# Altium schematic sheet Slave.SchDoc: Slave
size A3; Author: Arjan Blankestijn; Revision: V1; SheetNumber: 2; SheetTotal: 3; Author2: Bram Bremer; Team: 2024; ProjectPrettyName: BMS; Subsystem: Module Board
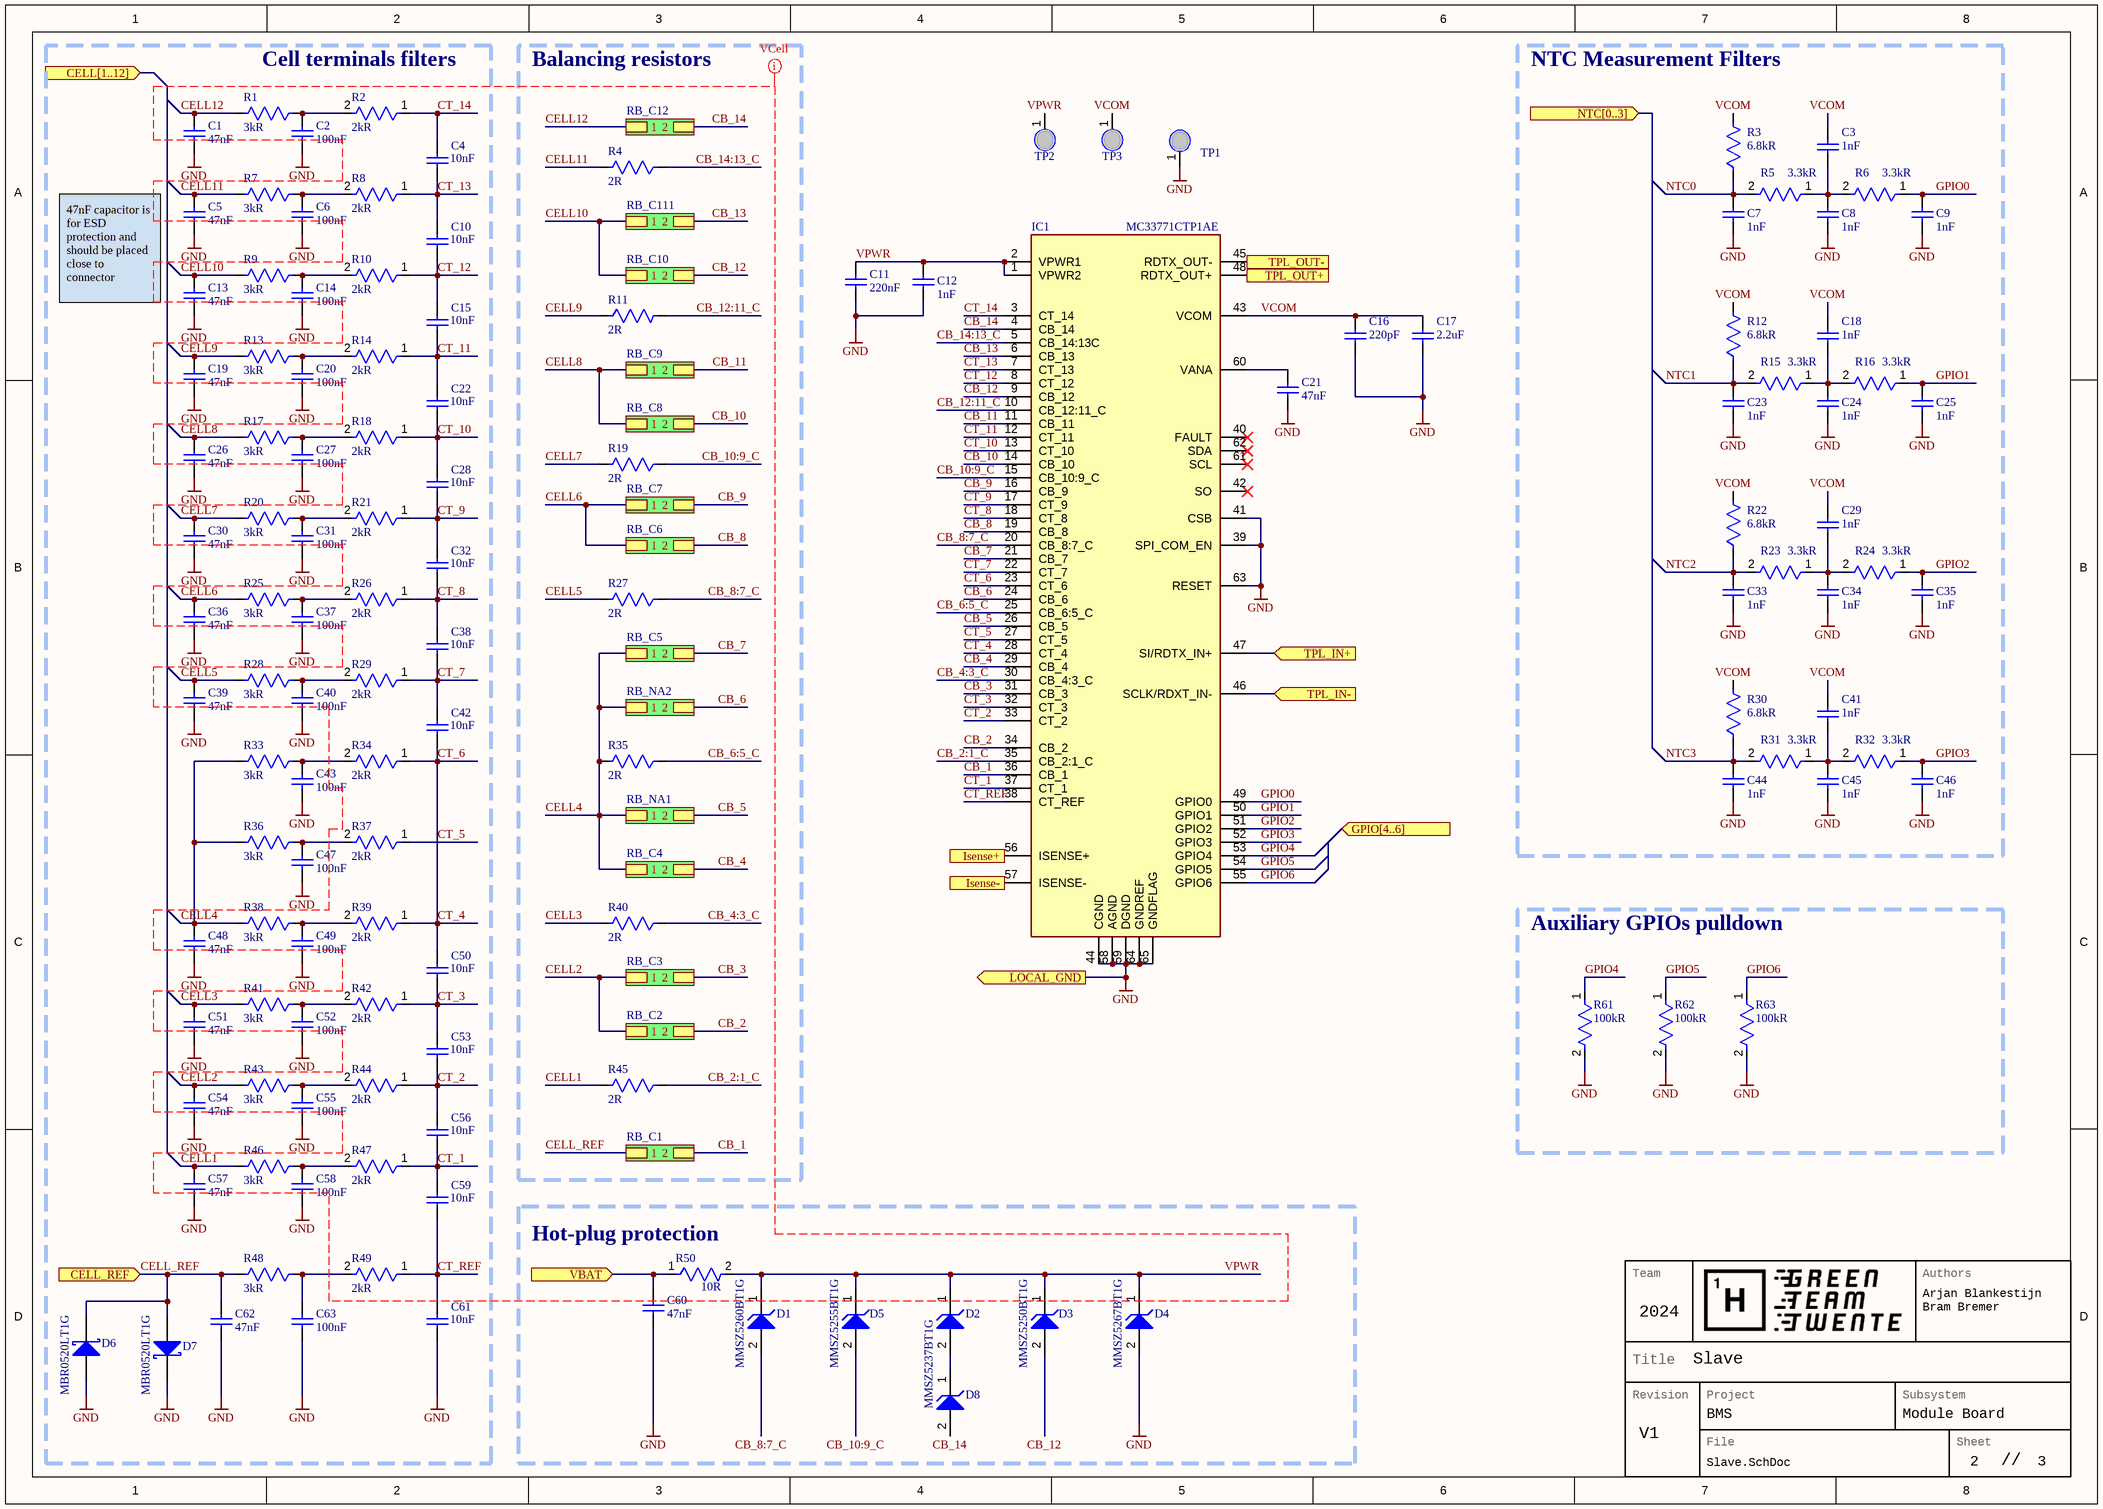
[diagram p0: Slave.SchDoc]

## Parts
C1  value 47nF  [WCAP-CSGP_0603_L1.6W0.8H0.8_Reflow]  (hidden comment: CAP 0603 47nF X7R)
C2  value 100nF  [WCAP-CSGP_0603_L1.6W0.8H0.8_Reflow]  (hidden comment: CAP 0603 100nF X7R)
C3  value 1nF  [WCAP-CSGP_0402_L1W0.5H0.5]  (hidden comment: CAP 0402 1nF X7R)
C4  value 10nF  [WCAP-CSGP_0402_L1W0.5H0.5]  (hidden comment: CAP 0402 10nF X7R)
C5  value 47nF  [WCAP-CSGP_0603_L1.6W0.8H0.8_Reflow]  (hidden comment: CAP 0603 47nF X7R)
C6  value 100nF  [WCAP-CSGP_0603_L1.6W0.8H0.8_Reflow]  (hidden comment: CAP 0603 100nF X7R)
C7  value 1nF  [WCAP-CSGP_0402_L1W0.5H0.5]  (hidden comment: CAP 0402 1nF X7R)
C8  value 1nF  [WCAP-CSGP_0402_L1W0.5H0.5]  (hidden comment: CAP 0402 1nF X7R)
C9  value 1nF  [WCAP-CSGP_0402_L1W0.5H0.5]  (hidden comment: CAP 0402 1nF X7R)
C10  value 10nF  [WCAP-CSGP_0402_L1W0.5H0.5]  (hidden comment: CAP 0402 10nF X7R)
C11  value 220nF  [WCAP-CSGP_0603_L1.6W0.8H0.8_Reflow]  (hidden comment: CAP 0603 220nF X7R)
C12  value 1nF  [WCAP-CSGP_0402_L1W0.5H0.5]  (hidden comment: CAP 0402 1nF X7R)
C13  value 47nF  [WCAP-CSGP_0603_L1.6W0.8H0.8_Reflow]  (hidden comment: CAP 0603 47nF X7R)
C14  value 100nF  [WCAP-CSGP_0603_L1.6W0.8H0.8_Reflow]  (hidden comment: CAP 0603 100nF X7R)
C15  value 10nF  [WCAP-CSGP_0402_L1W0.5H0.5]  (hidden comment: CAP 0402 10nF X7R)
C16  value 220pF  [WCAP-CSGP_0402_L1W0.5H0.5]  (hidden comment: CAP 0402 220pF X7R)
C17  value 2.2uF  [WCAP-CSGP_0603_L1.6W0.8H0.8_Reflow]  (hidden comment: CAP 0603 2.2uF X7R)
C18  value 1nF  [WCAP-CSGP_0402_L1W0.5H0.5]  (hidden comment: CAP 0402 1nF X7R)
C19  value 47nF  [WCAP-CSGP_0603_L1.6W0.8H0.8_Reflow]  (hidden comment: CAP 0603 47nF X7R)
C20  value 100nF  [WCAP-CSGP_0603_L1.6W0.8H0.8_Reflow]  (hidden comment: CAP 0603 100nF X7R)
C21  value 47nF  [WCAP-CSGP_0603_L1.6W0.8H0.8_Reflow]  (hidden comment: CAP 0603 47nF X7R)
C22  value 10nF  [WCAP-CSGP_0402_L1W0.5H0.5]  (hidden comment: CAP 0402 10nF X7R)
C23  value 1nF  [WCAP-CSGP_0402_L1W0.5H0.5]  (hidden comment: CAP 0402 1nF X7R)
C24  value 1nF  [WCAP-CSGP_0402_L1W0.5H0.5]  (hidden comment: CAP 0402 1nF X7R)
C25  value 1nF  [WCAP-CSGP_0402_L1W0.5H0.5]  (hidden comment: CAP 0402 1nF X7R)
C26  value 47nF  [WCAP-CSGP_0603_L1.6W0.8H0.8_Reflow]  (hidden comment: CAP 0603 47nF X7R)
C27  value 100nF  [WCAP-CSGP_0603_L1.6W0.8H0.8_Reflow]  (hidden comment: CAP 0603 100nF X7R)
C28  value 10nF  [WCAP-CSGP_0402_L1W0.5H0.5]  (hidden comment: CAP 0402 10nF X7R)
C29  value 1nF  [WCAP-CSGP_0402_L1W0.5H0.5]  (hidden comment: CAP 0402 1nF X7R)
C30  value 47nF  [WCAP-CSGP_0603_L1.6W0.8H0.8_Reflow]  (hidden comment: CAP 0603 47nF X7R)
C31  value 100nF  [WCAP-CSGP_0603_L1.6W0.8H0.8_Reflow]  (hidden comment: CAP 0603 100nF X7R)
C32  value 10nF  [WCAP-CSGP_0402_L1W0.5H0.5]  (hidden comment: CAP 0402 10nF X7R)
C33  value 1nF  [WCAP-CSGP_0402_L1W0.5H0.5]  (hidden comment: CAP 0402 1nF X7R)
C34  value 1nF  [WCAP-CSGP_0402_L1W0.5H0.5]  (hidden comment: CAP 0402 1nF X7R)
C35  value 1nF  [WCAP-CSGP_0402_L1W0.5H0.5]  (hidden comment: CAP 0402 1nF X7R)
C36  value 47nF  [WCAP-CSGP_0603_L1.6W0.8H0.8_Reflow]  (hidden comment: CAP 0603 47nF X7R)
C37  value 100nF  [WCAP-CSGP_0603_L1.6W0.8H0.8_Reflow]  (hidden comment: CAP 0603 100nF X7R)
C38  value 10nF  [WCAP-CSGP_0402_L1W0.5H0.5]  (hidden comment: CAP 0402 10nF X7R)
C39  value 47nF  [WCAP-CSGP_0603_L1.6W0.8H0.8_Reflow]  (hidden comment: CAP 0603 47nF X7R)
C40  value 100nF  [WCAP-CSGP_0603_L1.6W0.8H0.8_Reflow]  (hidden comment: CAP 0603 100nF X7R)
C41  value 1nF  [WCAP-CSGP_0402_L1W0.5H0.5]  (hidden comment: CAP 0402 1nF X7R)
C42  value 10nF  [WCAP-CSGP_0402_L1W0.5H0.5]  (hidden comment: CAP 0402 10nF X7R)
C43  value 100nF  [WCAP-CSGP_0603_L1.6W0.8H0.8_Reflow]  (hidden comment: CAP 0603 100nF X7R)
C44  value 1nF  [WCAP-CSGP_0402_L1W0.5H0.5]  (hidden comment: CAP 0402 1nF X7R)
C45  value 1nF  [WCAP-CSGP_0402_L1W0.5H0.5]  (hidden comment: CAP 0402 1nF X7R)
C46  value 1nF  [WCAP-CSGP_0402_L1W0.5H0.5]  (hidden comment: CAP 0402 1nF X7R)
C47  value 100nF  [WCAP-CSGP_0603_L1.6W0.8H0.8_Reflow]  (hidden comment: CAP 0603 100nF X7R)
C48  value 47nF  [WCAP-CSGP_0603_L1.6W0.8H0.8_Reflow]  (hidden comment: CAP 0603 47nF X7R)
C49  value 100nF  [WCAP-CSGP_0603_L1.6W0.8H0.8_Reflow]  (hidden comment: CAP 0603 100nF X7R)
C50  value 10nF  [WCAP-CSGP_0402_L1W0.5H0.5]  (hidden comment: CAP 0402 10nF X7R)
C51  value 47nF  [WCAP-CSGP_0603_L1.6W0.8H0.8_Reflow]  (hidden comment: CAP 0603 47nF X7R)
C52  value 100nF  [WCAP-CSGP_0603_L1.6W0.8H0.8_Reflow]  (hidden comment: CAP 0603 100nF X7R)
C53  value 10nF  [WCAP-CSGP_0402_L1W0.5H0.5]  (hidden comment: CAP 0402 10nF X7R)
C54  value 47nF  [WCAP-CSGP_0603_L1.6W0.8H0.8_Reflow]  (hidden comment: CAP 0603 47nF X7R)
C55  value 100nF  [WCAP-CSGP_0603_L1.6W0.8H0.8_Reflow]  (hidden comment: CAP 0603 100nF X7R)
C56  value 10nF  [WCAP-CSGP_0402_L1W0.5H0.5]  (hidden comment: CAP 0402 10nF X7R)
C57  value 47nF  [WCAP-CSGP_0603_L1.6W0.8H0.8_Reflow]  (hidden comment: CAP 0603 47nF X7R)
C58  value 100nF  [WCAP-CSGP_0603_L1.6W0.8H0.8_Reflow]  (hidden comment: CAP 0603 100nF X7R)
C59  value 10nF  [WCAP-CSGP_0402_L1W0.5H0.5]  (hidden comment: CAP 0402 10nF X7R)
C60  value 47nF  [WCAP-CSGP_0603_L1.6W0.8H0.8_Reflow]  (hidden comment: CAP 0603 47nF X7R)
C61  value 10nF  [WCAP-CSGP_0402_L1W0.5H0.5]  (hidden comment: CAP 0402 10nF X7R)
C62  value 47nF  [WCAP-CSGP_0603_L1.6W0.8H0.8_Reflow]  (hidden comment: CAP 0603 47nF X7R)
C63  value 100nF  [WCAP-CSGP_0603_L1.6W0.8H0.8_Reflow]  (hidden comment: CAP 0603 100nF X7R)
D1  MMSZ5260BT1G  [ONSC-SOD-123-2-425-04_V]
D2  MMSZ5237BT1G  [ONSC-SOD-123-2-425-04_V]
D3  MMSZ5250BT1G  [ONSC-SOD-123-2-425-04_V]
D4  MMSZ5267BT1G  [ONSC-SOD-123-2-425-04_V]
D5  MMSZ5255BT1G  [ONSC-SOD-123-2-425-04_V]
D6  MBR0520LT1G  [ONSC-SOD-123-2-425-04_V]
D7  MBR0520LT1G  [ONSC-SOD-123-2-425-04_V]
D8  MMSZ5237BT1G  [ONSC-SOD-123-2-425-04_V]  (value not drawn)
IC1  MC33771CTP1AE  [QFP50P1200X1200X160-65N]
R1  value 3kR  [RES_SM0603_YAGEORC_N]  (hidden comment: RES 0603 3kR 1%)
R2  value 2kR  [FP0402]  (hidden comment: RES 0402 2kR 1%)
R3  value 6.8kR  [RES_SM0603_YAGEORC_N]  (hidden comment: RES 0603 6.8kR 1%)
R4  value 2R  [RES_SM0603_YAGEORC_N]  (hidden comment: RES 0603 2R 1%)
R5  value 3.3kR  [FP0402]  (hidden comment: RES 0402 3.3kR 1%)
R6  value 3.3kR  [FP0402]  (hidden comment: RES 0402 3.3kR 1%)
R7  value 3kR  [RES_SM0603_YAGEORC_N]  (hidden comment: RES 0603 3kR 1%)
R8  value 2kR  [FP0402]  (hidden comment: RES 0402 2kR 1%)
R9  value 3kR  [RES_SM0603_YAGEORC_N]  (hidden comment: RES 0603 3kR 1%)
R10  value 2kR  [FP0402]  (hidden comment: RES 0402 2kR 1%)
R11  value 2R  [RES_SM0603_YAGEORC_N]  (hidden comment: RES 0603 2R 1%)
R12  value 6.8kR  [RES_SM0603_YAGEORC_N]  (hidden comment: RES 0603 6.8kR 1%)
R13  value 3kR  [RES_SM0603_YAGEORC_N]  (hidden comment: RES 0603 3kR 1%)
R14  value 2kR  [FP0402]  (hidden comment: RES 0402 2kR 1%)
R15  value 3.3kR  [FP0402]  (hidden comment: RES 0402 3.3kR 1%)
R16  value 3.3kR  [FP0402]  (hidden comment: RES 0402 3.3kR 1%)
R17  value 3kR  [RES_SM0603_YAGEORC_N]  (hidden comment: RES 0603 3kR 1%)
R18  value 2kR  [FP0402]  (hidden comment: RES 0402 2kR 1%)
R19  value 2R  [RES_SM0603_YAGEORC_N]  (hidden comment: RES 0603 2R 1%)
R20  value 3kR  [RES_SM0603_YAGEORC_N]  (hidden comment: RES 0603 3kR 1%)
R21  value 2kR  [FP0402]  (hidden comment: RES 0402 2kR 1%)
R22  value 6.8kR  [RES_SM0603_YAGEORC_N]  (hidden comment: RES 0603 6.8kR 1%)
R23  value 3.3kR  [FP0402]  (hidden comment: RES 0402 3.3kR 1%)
R24  value 3.3kR  [FP0402]  (hidden comment: RES 0402 3.3kR 1%)
R25  value 3kR  [RES_SM0603_YAGEORC_N]  (hidden comment: RES 0603 3kR 1%)
R26  value 2kR  [FP0402]  (hidden comment: RES 0402 2kR 1%)
R27  value 2R  [RES_SM0603_YAGEORC_N]  (hidden comment: RES 0603 2R 1%)
R28  value 3kR  [RES_SM0603_YAGEORC_N]  (hidden comment: RES 0603 3kR 1%)
R29  value 2kR  [FP0402]  (hidden comment: RES 0402 2kR 1%)
R30  value 6.8kR  [RES_SM0603_YAGEORC_N]  (hidden comment: RES 0603 6.8kR 1%)
R31  value 3.3kR  [FP0402]  (hidden comment: RES 0402 3.3kR 1%)
R32  value 3.3kR  [FP0402]  (hidden comment: RES 0402 3.3kR 1%)
R33  value 3kR  [RES_SM0603_YAGEORC_N]  (hidden comment: RES 0603 3kR 1%)
R34  value 2kR  [FP0402]  (hidden comment: RES 0402 2kR 1%)
R35  value 2R  [RES_SM0603_YAGEORC_N]  (hidden comment: RES 0603 2R 1%)
R36  value 3kR  [RES_SM0603_YAGEORC_N]  (hidden comment: RES 0603 3kR 1%)
R37  value 2kR  [FP0402]  (hidden comment: RES 0402 2kR 1%)
R38  value 3kR  [RES_SM0603_YAGEORC_N]  (hidden comment: RES 0603 3kR 1%)
R39  value 2kR  [FP0402]  (hidden comment: RES 0402 2kR 1%)
R40  value 2R  [RES_SM0603_YAGEORC_N]  (hidden comment: RES 0603 2R 1%)
R41  value 3kR  [RES_SM0603_YAGEORC_N]  (hidden comment: RES 0603 3kR 1%)
R42  value 2kR  [FP0402]  (hidden comment: RES 0402 2kR 1%)
R43  value 3kR  [RES_SM0603_YAGEORC_N]  (hidden comment: RES 0603 3kR 1%)
R44  value 2kR  [FP0402]  (hidden comment: RES 0402 2kR 1%)
R45  value 2R  [RES_SM0603_YAGEORC_N]  (hidden comment: RES 0603 2R 1%)
R46  value 3kR  [RES_SM0603_YAGEORC_N]  (hidden comment: RES 0603 3kR 1%)
R47  value 2kR  [FP0402]  (hidden comment: RES 0402 2kR 1%)
R48  value 3kR  [RES_SM0603_YAGEORC_N]  (hidden comment: RES 0603 3kR 1%)
R49  value 2kR  [FP0402]  (hidden comment: RES 0402 2kR 1%)
R50  value 10R  [RES_SM1206_YAGEORC_N]  (hidden comment: RES 1206 10R 1%)
R61  value 100kR  [FP0402]  (hidden comment: RES 0402 100kR 1%)
R62  value 100kR  [FP0402]  (hidden comment: RES 0402 100kR 1%)
R63  value 100kR  [FP0402]  (hidden comment: RES 0402 100kR 1%)
TP1  GTT_ProbeerPunt  [GTT_ProbeerPuntFP]  (value not drawn)  (no BOM)
TP2  GTT_ProbeerPunt  [GTT_ProbeerPuntFP]  (value not drawn)  (no BOM)
TP3  GTT_ProbeerPunt  [GTT_ProbeerPuntFP]  (value not drawn)  (no BOM)

## Blocks framed on the sheet
Cell terminals filters: C1 C2 C4-C6 C10 C13-C15 C19 C20 C22 C26-C28 C30-C32 C36-C40 C42 C43 C47-C59 C61-C63 D6 D7 R1 R2 R7-R10 R13 R14 R17 R18 R20 R21 R25 R26 R28 R29 R33 R34 R36-R39 R41-R44 R46-R49
Balancing resistors: R4 R11 R19 R27 R35 R40 R45
NTC Measurement Filters: C3 C7-C9 C18 C23-C25 C29 C33-C35 C41 C44-C46 R3 R5 R6 R12 R15 R16 R22-R24 R30-R32
Auxiliary GPIOs pulldown: R61-R63
Hot-plug protection: C60 D1-D5 D8 R50

## Sub-sheets
RB_C1 = BalancingNetwork.SchDoc: 1, 2
RB_C2 = BalancingNetwork.SchDoc: 1, 2
RB_C3 = BalancingNetwork.SchDoc: 1, 2
RB_C4 = BalancingNetwork.SchDoc: 1, 2
RB_C5 = BalancingNetwork.SchDoc: 1, 2
RB_C6 = BalancingNetwork.SchDoc: 1, 2
RB_C7 = BalancingNetwork.SchDoc: 1, 2
RB_C8 = BalancingNetwork.SchDoc: 1, 2
RB_C9 = BalancingNetwork.SchDoc: 1, 2
RB_C10 = BalancingNetwork.SchDoc: 1, 2
RB_C12 = BalancingNetwork.SchDoc: 1, 2
RB_C111 = BalancingNetwork.SchDoc: 1, 2
RB_NA1 = BalancingNetwork.SchDoc: 1, 2
RB_NA2 = BalancingNetwork.SchDoc: 1, 2

## Ports
CELL[1..12] (in), CELL_REF (in), GPIO[4..6] (in), Isense+ (in), Isense- (in), LOCAL_GND (out), NTC[0..3] (in), TPL_IN+ (in), TPL_IN- (in), TPL_OUT+ (out), TPL_OUT- (out), VBAT (in)

## Nets
GND: C1.1 C2.1 C5.1 C6.1 C7.1 C8.1 C9.1 C11.1 C12.1 C13.1 C14.1 C16.1 C17.1 C19.1 C20.1 C21.1 C23.1 C24.1 C25.1 C26.1 C27.1 C30.1 C31.1 C33.1 C34.1 C35.1 C36.1 C37.1 C39.1 C40.1 C43.1 C44.1 C45.1 C46.1 C47.1 C48.1 C49.1 C51.1 C52.1 C54.1 C55.1 C57.1 C58.1 C60.1 C61.1 C62.1 C63.1 D4.2(A) D6.1(A) D7.2(K) IC1.39(SPI_COM_EN) IC1.41(CSB) IC1.44(CGND) IC1.58(AGND) IC1.59(DGND) IC1.63(RESET) IC1.64(GNDREF) IC1.65(GNDFLAG) R61.2 R62.2 R63.2 TP1.1 ; port LOCAL_GND
CB_1: IC1.36(CB_1) ; sheet RB_C1/2
CB_2: IC1.34(CB_2) ; sheet RB_C2/2
CB_2:1_C: IC1.35(CB_2:1_C) R45.1
CB_3: IC1.31(CB_3) ; sheet RB_C3/2
CB_4: IC1.29(CB_4) ; sheet RB_C4/2
CB_4:3_C: IC1.30(CB_4:3_C) R40.1
CB_5: IC1.26(CB_5) ; sheet RB_NA1/2
CB_6: IC1.24(CB_6) ; sheet RB_NA2/2
CB_6:5_C: IC1.25(CB_6:5_C) R35.1
CB_7: IC1.21(CB_7) ; sheet RB_C5/2
CB_8: IC1.19(CB_8) ; sheet RB_C6/2
CB_8:7_C: D1.2(A) IC1.20(CB_8:7_C) R27.1
CB_9: IC1.16(CB_9) ; sheet RB_C7/2
CB_10: IC1.14(CB_10) ; sheet RB_C8/2
CB_10:9_C: D5.2(A) IC1.15(CB_10:9_C) R19.1
CB_11: IC1.11(CB_11) ; sheet RB_C9/2
CB_12: D3.2(A) IC1.9(CB_12) ; sheet RB_C10/2
CB_12:11_C: IC1.10(CB_12:11_C) R11.2
CB_13: IC1.6(CB_13) ; sheet RB_C111/2
CB_14: D8.2(A) IC1.4(CB_14) ; sheet RB_C12/2
CB_14:13_C: IC1.5(CB_14:13C) R4.1
CELL1: C57.2 R45.2 R46.2
CELL2: C54.2 R43.2 ; sheet RB_C3/1, sheet RB_C2/1
CELL3: C51.2 R40.2 R41.2
CELL4: C48.2 R33.2 R35.2 R36.2 R38.2 ; sheet RB_NA1/1, sheet RB_C4/1, sheet RB_C5/1, sheet RB_NA2/1
CELL5: C39.2 R27.2 R28.2
CELL6: C36.2 R25.2 ; sheet RB_C7/1, sheet RB_C6/1
CELL7: C30.2 R19.2 R20.2
CELL8: C26.2 R17.2 ; sheet RB_C9/1, sheet RB_C8/1
CELL9: C19.2 R11.1 R13.2
CELL10: C13.2 R9.2 ; sheet RB_C10/1, sheet RB_C111/1
CELL11: C5.2 R4.2 R7.2
CELL12: C1.2 R1.2 ; sheet RB_C12/1
CELL_REF: C62.2 D6.2(K) D7.1(A) R48.2 ; port CELL_REF, sheet RB_C1/1
CT_1: C56.1 C59.2 IC1.37(CT_1) R47.1
CT_2: C53.1 C56.2 IC1.33(CT_2) R44.1
CT_3: C50.1 C53.2 IC1.32(CT_3) R42.1
CT_4: C42.1 C50.2 IC1.23(CT_6) IC1.27(CT_5) IC1.28(CT_4) R34.1 R37.1 R39.1  [also labelled CT_5, CT_6]
CT_7: C38.1 C42.2 IC1.22(CT_7) R29.1
CT_8: C32.1 C38.2 IC1.18(CT_8) R26.1
CT_9: C28.1 C32.2 IC1.17(CT_9) R21.1
CT_10: C22.1 C28.2 IC1.13(CT_10) R18.1
CT_11: C15.1 C22.2 IC1.12(CT_11) R14.1
CT_12: C10.1 C15.2 IC1.8(CT_12) R10.1
CT_13: C4.1 C10.2 IC1.7(CT_13) R8.1
CT_14: C4.2 IC1.3(CT_14) R2.1
CT_REF: C59.1 C61.2 IC1.38(CT_REF) R49.1
GPIO0: C9.2 IC1.49(GPIO0) R6.1
GPIO1: C25.2 IC1.50(GPIO1) R16.1
GPIO2: C35.2 IC1.51(GPIO2) R24.1
GPIO3: C46.2 IC1.52(GPIO3) R32.1
GPIO4: IC1.53(GPIO4) R61.1
GPIO5: IC1.54(GPIO5) R62.1
GPIO6: IC1.55(GPIO6) R63.1
Isense+: IC1.56(ISENSE+) ; port Isense+
Isense-: IC1.57(ISENSE-) ; port Isense-
NTC0: C7.2 R3.1 R5.2
NTC1: C23.2 R12.1 R15.2
NTC2: C33.2 R22.1 R23.2
NTC3: C44.2 R30.1 R31.2
TPL_IN+: IC1.47(SI/RDTX_IN+) ; port TPL_IN+
TPL_IN-: IC1.46(SCLK/RDXT_IN-) ; port TPL_IN-
TPL_OUT+: IC1.48(RDTX_OUT+) ; port TPL_OUT+
TPL_OUT-: IC1.45(RDTX_OUT-) ; port TPL_OUT-
VBAT: C60.2 R50.1 ; port VBAT
VCOM: C3.2 C16.2 C17.2 C18.2 C29.2 C41.2 IC1.43(VCOM) R3.2 R12.2 R22.2 R30.2 TP3.1
VPWR: C11.2 C12.2 D1.1(K) D2.1(K) D3.1(K) D4.1(K) D5.1(K) IC1.1(VPWR2) IC1.2(VPWR1) R50.2 TP2.1
NetC2_2: C2.2 R1.1 R2.2
NetC3_1: C3.1 C8.2 R5.1 R6.2
NetC6_2: C6.2 R7.1 R8.2
NetC14_2: C14.2 R9.1 R10.2
NetC18_1: C18.1 C24.2 R15.1 R16.2
NetC20_2: C20.2 R13.1 R14.2
NetC21_2: C21.2 IC1.60(VANA)
NetC27_2: C27.2 R17.1 R18.2
NetC29_1: C29.1 C34.2 R23.1 R24.2
NetC31_2: C31.2 R20.1 R21.2
NetC37_2: C37.2 R25.1 R26.2
NetC40_2: C40.2 R28.1 R29.2
NetC41_1: C41.1 C45.2 R31.1 R32.2
NetC43_2: C43.2 R33.1 R34.2
NetC47_2: C47.2 R36.1 R37.2
NetC49_2: C49.2 R38.1 R39.2
NetC52_2: C52.2 R41.1 R42.2
NetC55_2: C55.2 R43.1 R44.2
NetC58_2: C58.2 R46.1 R47.2
NetC63_2: C63.2 R48.1 R49.2
NetD2_2: D2.2(A) D8.1(K)

Not connected (* = marked no-connect by the designer): IC1 40(FAULT)* 42(SO)* 61(SCL)* 62(SDA)*

## Layout directives
rule Clearance Constraint [Generic clearance = 0.5mm, and 18 value(s) for objects]: CB_1, CB_2, CB_2:1_C, CB_3, CB_4, CB_4:3_C, CB_5, CB_6, CB_6:5_C, CB_7, CB_8, CB_8:7_C, CB_9, CB_10, CB_10:9_C, CB_11, CB_12, CB_12:11_C, CB_13, CB_14, CB_14:13_C, CELL1, CELL2, CELL3, CELL4, CELL5, CELL6, CELL7, CELL8, CELL9, CELL10, CELL11, CELL12, CELL_REF, CT_1, CT_2, CT_3, CT_4, CT_5, CT_6, CT_7, CT_8, CT_9, CT_10, CT_11, CT_12, CT_13, CT_14, CT_REF, VPWR

## Notes on the sheet
- 47nF capacitor is for ESD protection and should be placed close to connector
- Team
- Authors
- Revision
- Title
- Project
- Subsystem
- File
- Sheet
- //

## Library data of the parts
C1 C2 C5 C6 C11 C13 C14 C17 C19-C21 C26 C27 C30 C31 C36 C37 C39 C40 C43 C47-C49 C51 C52 C54 C55 C57 C58 C60 C62 C63 = CMP-001-01309-1: GTT Standard 0603 non-polarized capacitor; Voltage Rating: 100V; Tolerance: 5%; Case/Package: 0603; Category: Multilayer Ceramic Chip Capacitors; Ceramic Type: X7R; Pins: 2
  C1 C5 C13 C19 C21 C26 C30 C36 C39 C48 C51 C54 C57 C60 C62: JLCPCB Part #: C1622
  C2 C6 C14 C20 C27 C31 C37 C40 C43 C47 C49 C52 C55 C58 C63: JLCPCB Part #: C14663
  C11: JLCPCB Part #: C21120
  C17: JLCPCB Part #: C23630
C3 C4 C7-C10 C12 C15 C16 C18 C22-C25 C28 C29 C32-C35 C38 C41 C42 C44-C46 C50 C53 C56 C59 C61 = CMP-001-01308-5: GTT Standard 0402 non-polarized capacitor; Pins: 2; Case/Package: 0402; Category: Multilayer Ceramic Chip Capacitors; Ceramic Type: X7R
  C3 C7-C9 C12 C18 C23-C25 C29 C33-C35 C41 C44-C46: JLCPCB Part #: C1523
  C4 C10 C15 C22 C28 C32 C38 C42 C50 C53 C56 C59 C61: JLCPCB Part #: C15195
  C16: JLCPCB Part #: C1530
D1 = CMP-1060-00447-1: Zener Voltage Regulator, 500 mW, 2-Pin SOD-123, Pb-Free, Tape and Reel; Manufacturer: On Semiconductor; VZ Typ (V): 43; P Max (W): 0.5; Packing: Tape and Reel; ComponentLink3URL: http://www.onsemi.com/pub_link/Collateral/425-04.PDF; DatasheetVersion: Rev. 12; ComponentLink1URL: http://www.onsemi.com/; ComponentLink3Description: Package Specification; PackageVersion: Rev. G, 10/2009; PartNumber: MMSZ5260BT1G; ComponentLink1Description: Manufacturer URL; PackageReference: SOD-123-2-425-04; ComponentLink2URL: http://www.onsemi.com/pub_link/Collateral/MMSZ5221BT1-D.PDF; Mounting Technology: Surface Mount; PackageDescription: 2-Pin SOD, Body 1.6 x 2.69 mm; RoHS: Pb-Free; ComponentLink2Description: Datasheet
D2 D8 = CMP-1060-00553-1: Zener Voltage Regulator, 500 mW, 2-Pin SOD-123, Pb-Free, Tape and Reel; Manufacturer: On Semiconductor; P Max (W): 0.5; VZ Typ (V): 8.2; PartNumber: MMSZ5237BT1G; DatasheetVersion: Rev. 12; ComponentLink1URL: http://www.onsemi.com/; PackageDescription: 2-Pin SOD, Body 1.6 x 2.69 mm; ComponentLink1Description: Manufacturer URL; ComponentLink2URL: http://www.onsemi.com/pub_link/Collateral/MMSZ5221BT1-D.PDF; RoHS: Pb-Free; ComponentLink3URL: http://www.onsemi.com/pub_link/Collateral/425-04.PDF; Mounting Technology: Surface Mount; PackageVersion: Rev. G, 10/2009; ComponentLink2Description: Datasheet; ComponentLink3Description: Package Specification; Packing: Tape and Reel; PackageReference: SOD-123-2-425-04
D3 = CMP-1060-00445-1: Zener Voltage Regulator, 500 mW, 2-Pin SOD-123, Pb-Free, Tape and Reel; Manufacturer: On Semiconductor; VZ Typ (V): 20; P Max (W): 0.5; ComponentLink1URL: http://www.onsemi.com/; ComponentLink2URL: http://www.onsemi.com/pub_link/Collateral/MMSZ5221BT1-D.PDF; Packing: Tape and Reel; ComponentLink3URL: http://www.onsemi.com/pub_link/Collateral/425-04.PDF; ComponentLink3Description: Package Specification; Mounting Technology: Surface Mount; PartNumber: MMSZ5250BT1G; PackageDescription: 2-Pin SOD, Body 1.6 x 2.69 mm; ComponentLink2Description: Datasheet; PackageReference: SOD-123-2-425-04; ComponentLink1Description: Manufacturer URL; PackageVersion: Rev. G, 10/2009; DatasheetVersion: Rev. 12; RoHS: Pb-Free; JLCPCB Part #: C94386
D4 = CMP-1060-00361-1: Zener Voltage Regulator, 500 mW, 2-Pin SOD-123, Pb-Free, Tape and Reel; Manufacturer: On Semiconductor; VZ Typ (V): 75; P Max (W): 0.5; PartNumber: MMSZ5267BT1G; ComponentLink3URL: http://www.onsemi.com/pub_link/Collateral/425-04.PDF; ComponentLink1URL: http://www.onsemi.com/; ComponentLink1Description: Manufacturer URL; ComponentLink2URL: http://www.onsemi.com/pub_link/Collateral/MMSZ5221BT1-D.PDF; Packing: Tape and Reel; Mounting Technology: Surface Mount; DatasheetVersion: Rev. 12; PackageDescription: 2-Pin SOD, Body 1.6 x 2.69 mm; ComponentLink2Description: Datasheet; RoHS: Pb-Free; ComponentLink3Description: Package Specification; PackageVersion: Rev. G, 10/2009; PackageReference: SOD-123-2-425-04; JLCPCB Part #: C80160
D5 = CMP-1060-00445-1: MMSZ5255BT1 Series 500 mW 10 mA 28 V SMT Zener Voltage Regulator - SOD-123; PartNumber: MMSZ5250BT1G; Manufacturer: On Semiconductor; Packing: Tape and Reel; VZ Typ (V): 20; P Max (W): 0.5; ComponentLink1URL: http://www.onsemi.com/; ComponentLink2URL: http://www.onsemi.com/pub_link/Collateral/MMSZ5221BT1-D.PDF; ComponentLink3URL: http://www.onsemi.com/pub_link/Collateral/425-04.PDF; ComponentLink3Description: Package Specification; Mounting Technology: Surface Mount; PackageDescription: 2-Pin SOD, Body 1.6 x 2.69 mm; ComponentLink2Description: Datasheet; PackageReference: SOD-123-2-425-04; ComponentLink1Description: Manufacturer URL; PackageVersion: Rev. G, 10/2009; DatasheetVersion: Rev. 12; RoHS: Pb-Free
D6 D7 = CMP-004-00003-1: Schottky Power Rectifier, 20 V, 5.5 A, -65 to 125 degC, 2-Pin SMD, RoHS, Tape and Reel; Manufacturer: ON Semiconductor; Peak Reverse Current: 250uA; Max Surge Current: 5.5A; Forward Voltage: 3.85dV; Forward Current: 5dA; Elements: 1; Datasheet Version: Rev. 6, 01/2012; Max Operating Temperature: 125°C; RoHS Compliant: True; Manufacturer URL: http://www.onsemi.com/; Packaging: TapeandReel; Datasheet URL: http://www.onsemi.cn/pub_link/Collateral/MBR0520LT1-D.PDF; Package Reference: SOD-123-2-425-04; Package Quantity: 3000; Min Operating Temperature: -65°C; Mounting Technology: SM; Package Description: 2-Pin Surface Mount Device, Body 2.69 x 1.6 mm; Case/Package: SOD; Pins: 2
IC1 = CMP-031-00033-2: Integrated Circuit; Manufacturer_Name: NXP; Design Item ID: MC33771CTP1AE; Arrow Part Number: MC33771CTP1AE; Mouser Price/Stock: https://www.mouser.co.uk/ProductDetail/NXP-Semiconductors/MC33771CTP1AE?qs=wnTfsH77Xs56aES1BMo%252B4w%3D%3D; Arrow Price/Stock: https://www.arrow.com/en/products/mc33771ctp1ae/nxp-semiconductors?region=europe; Height: 1.6mm; Source: TempSchematics.schlib; Datasheet Link: https://eu.mouser.com/datasheet/2/302/PB_MC33771C-1949877.pdf; Manufacturer_Part_Number: MC33771CTP1AE; Mouser Part Number: 771-MC33771CTP1AE
R1 R3 R7 R9 R12 R13 R17 R20 R22 R25 R28 R30 R33 R36 R38 R41 R43 R46 R48 = CMP-009-00206-3: GTT Standard 0603 Resistor; Power: 62.5mW; Voltage Rating: 50V; Tolerance: 1%; Mounting Technology: SMD; Case/Package: 0603
  R1 R7 R9 R13 R17 R20 R25 R28 R33 R36 R38 R41 R43 R46 R48: JLCPCB Part #: C4211
  R3 R12 R22 R30: JLCPCB Part #: C23212
R2 R5 R6 R8 R10 R14-R16 R18 R21 R23 R24 R26 R29 R31 R32 R34 R37 R39 R42 R44 R47 R49 R61-R63 = CMP-009-00204-16: GTT Standard 0402 Resistor; Voltage Rating: 50V; Power: 62.5mW; Case/Package: 0402; Mounting Technology: SMD; Design Item ID: RES 0402; Source: Passives.SchLib; Tolerance: 1%
  R2 R8 R10 R14 R18 R21 R26 R29 R34 R37 R39 R42 R44 R47 R49: JLCPCB Part #: C4109
  R5 R6 R15 R16 R23 R24 R31 R32: JLCPCB Part #: C25890
  R61-R63: JLCPCB Part #: C25741
R4 R11 R19 R27 R35 R40 R45 = CMP-009-00206-3: GTT Standard 0603 Resistor; Power: 100mW; Voltage Rating: 50V; Tolerance: 1%; Mounting Technology: SMD; Case/Package: 0603; JLCPCB Part #: C22977
R50 = CMP-009-00208-2: GTT Standard 1206 Resistor; Voltage Rating: 50V; Power: 250mW; Mounting Technology: SMD; Tolerance: 1%; Case/Package: 1206; JLCPCB Part #: C17903
TP1-TP3 = CMP-00030-00001-6: Design Item ID: GTT_ProbeerPunt; Source: GTT_MainComponentLibrary.SchLib